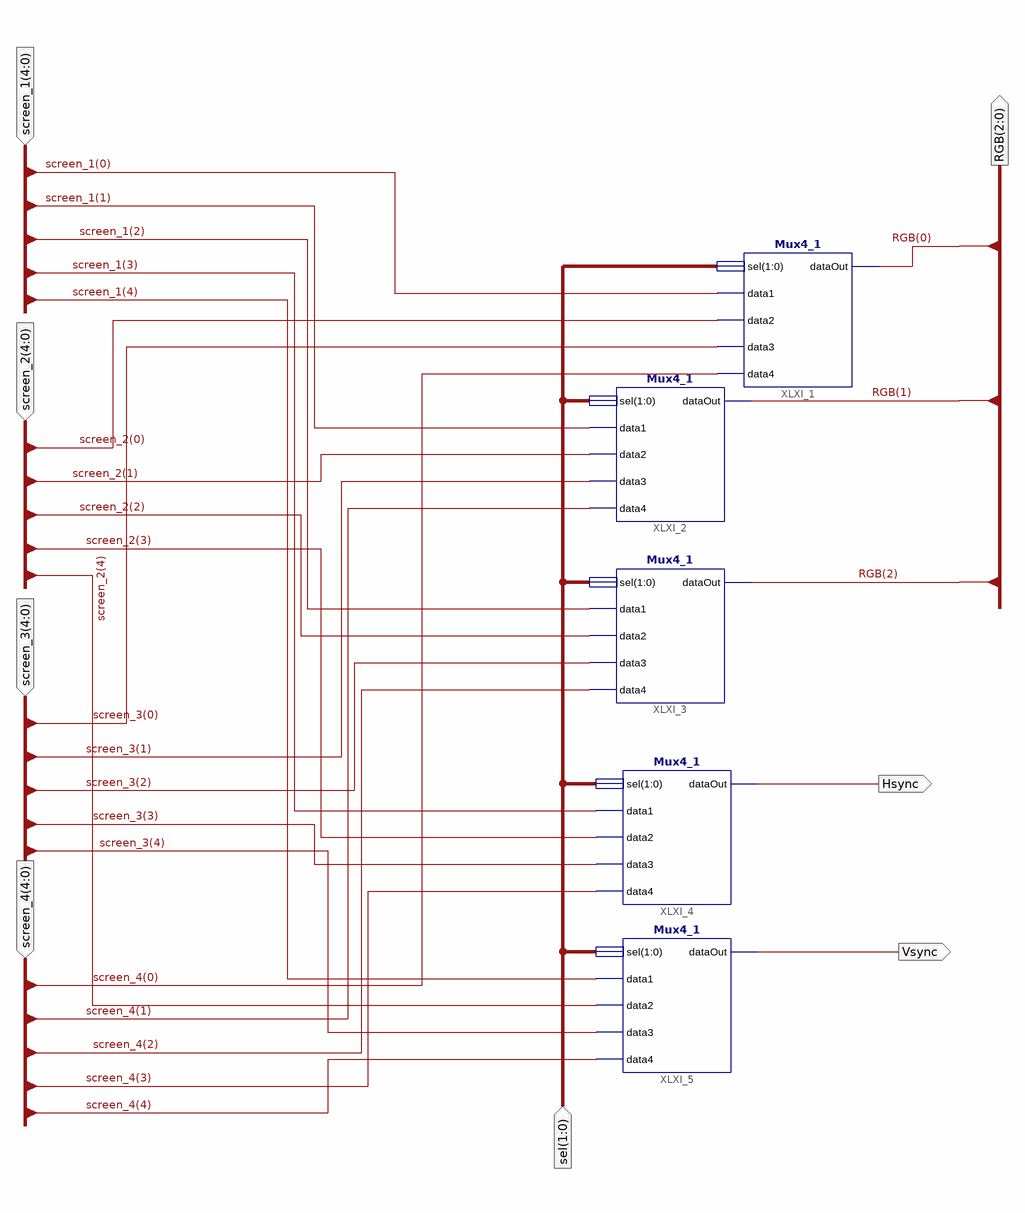
[diagram p0: schematic sheet 1]
// Xilinx ISE schematic SceneSelector.sch (spartan6) as structural Verilog: 5 symbols, 8 ports
module SceneSelector (
  input  [4:0] screen_1,
  input  [4:0] screen_2,
  input  [4:0] screen_3,
  input  [4:0] screen_4,
  input  [1:0] sel,
  output Hsync,
  output Vsync,
  output [2:0] RGB
);

  Mux4_1 XLXI_1 (
    .sel(sel), .dataOut(RGB[0]), .data1(screen_1[0]), .data3(screen_3[0]), .data2(screen_2[0]),
    .data4(screen_4[0]));
  Mux4_1 XLXI_2 (
    .sel(sel), .dataOut(RGB[1]), .data1(screen_1[1]), .data3(screen_3[1]), .data2(screen_2[1]),
    .data4(screen_4[1]));
  Mux4_1 XLXI_3 (
    .sel(sel), .dataOut(RGB[2]), .data1(screen_1[2]), .data3(screen_3[2]), .data2(screen_2[2]),
    .data4(screen_4[2]));
  Mux4_1 XLXI_4 (
    .sel(sel), .dataOut(Hsync), .data1(screen_1[3]), .data3(screen_3[3]), .data2(screen_2[3]),
    .data4(screen_4[3]));
  Mux4_1 XLXI_5 (
    .sel(sel), .dataOut(Vsync), .data1(screen_1[4]), .data3(screen_3[4]), .data2(screen_2[4]),
    .data4(screen_4[4]));
endmodule
